# Altium schematic sheet Motor.SchDoc
size A4
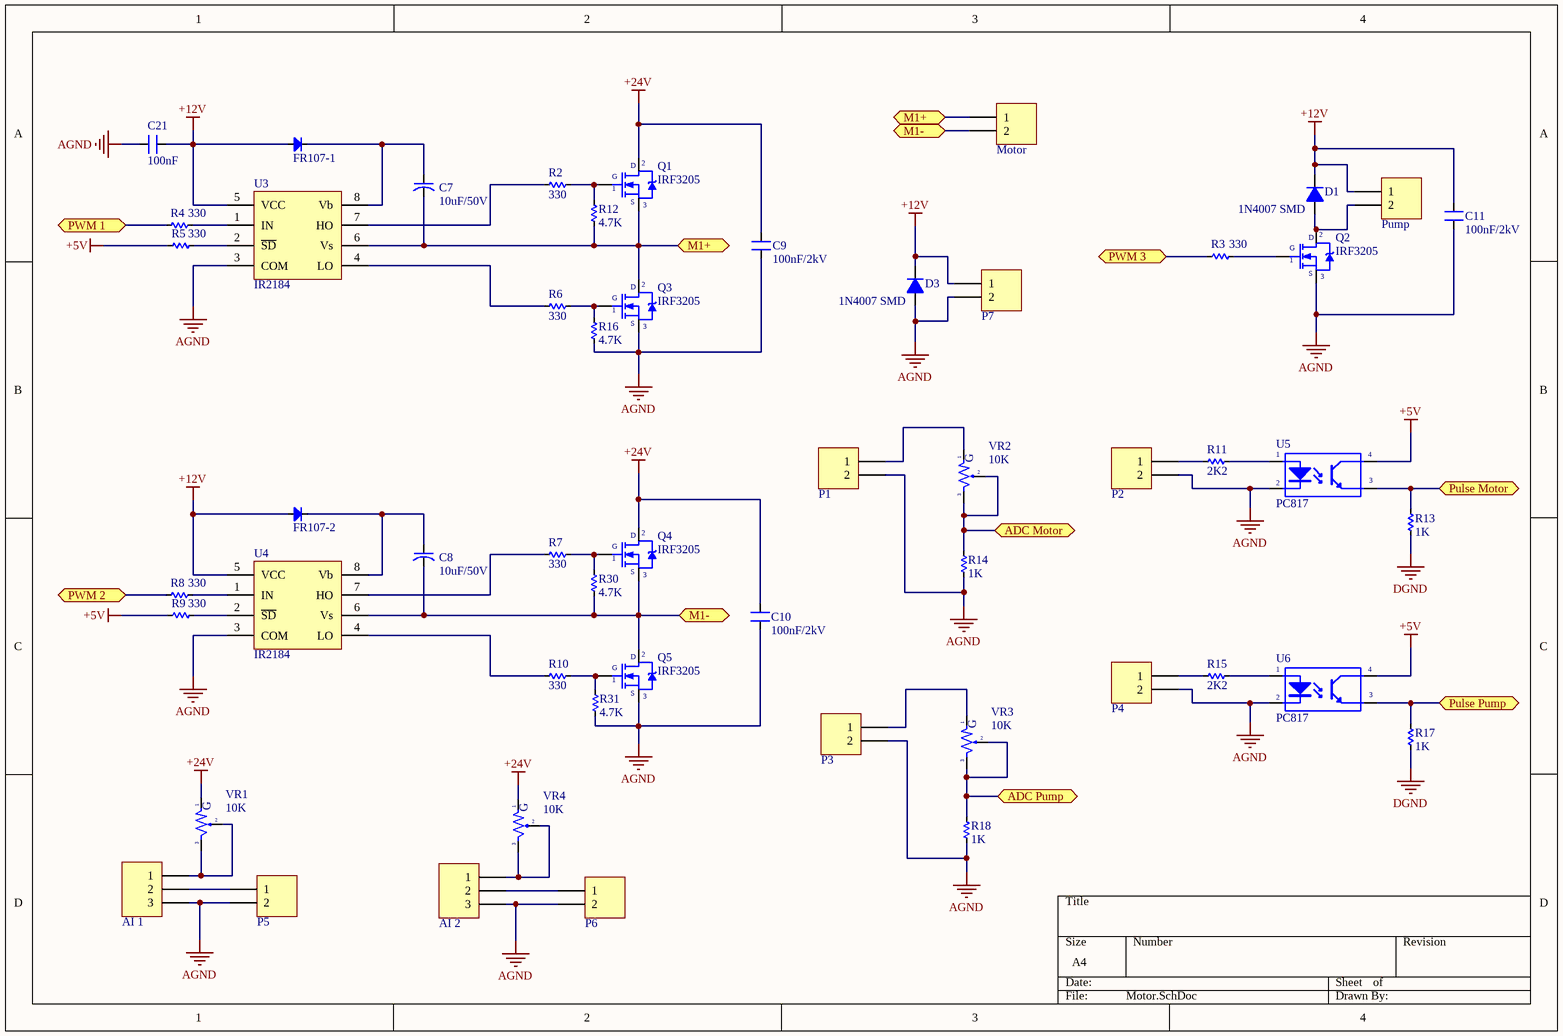
[diagram p0: Motor.SchDoc]

## Parts
AI_1  Domino 3  [Header Bus 3]  (value not drawn)
AI_2  Domino 3  [Header Bus 3]  (value not drawn)
C7  10uF/50V  [10uF/16V]
C8  10uF/50V  [10uF/16V]
C9  100nF/2kV  [CN3]
C10  100nF/2kV  [CN3]
C11  100nF/2kV  [CN3]
C21  100nF  [CN-SMD-0805]
D1  1N4007 SMD  [1N4004-M4 SMD]
D3  1N4007 SMD  [1N4004-M4 SMD]
FR107-1  Diode  [SS34]  (value not drawn)
FR107-2  Diode  [SS34]  (value not drawn)
Motor  Domino 2H  [DOMINO 2-5mm -H]  (value not drawn)
P1  Domino 2  [Header Bus 2]  (value not drawn)
P2  Domino 2  [Header Bus 2]  (value not drawn)
P3  Domino 2  [Header Bus 2]  (value not drawn)
P4  Domino 2  [Header Bus 2]  (value not drawn)
P5  Domino 2  [Header Bus 2]  (value not drawn)
P6  Domino 2  [Header Bus 2]  (value not drawn)
P7  Domino 2  [Header Bus 2]  (value not drawn)
Pump  Domino 2H  [DOMINO 2-5mm -H]  (value not drawn)
Q1  IRF3205  [TO220-123]
Q2  IRF3205  [TO220-123]
Q3  IRF3205  [TO220-123]
Q4  IRF3205  [TO220-123]
Q5  IRF3205  [TO220-123]
R2  330  [RES-SM-0805]
R3  330  [RES-SM-0805]
R4  330  [RES-SM-0805]
R5  330  [RES-SM-0805]
R6  330  [RES-SM-0805]
R7  330  [RES-SM-0805]
R8  330  [RES-SM-0805]
R9  330  [RES-SM-0805]
R10  330  [RES-SM-0805]
R11  2K2  [RES-SM-0805]
R12  4.7K  [RES-1/2W]
R13  1K  [RES-SM-0805]
R14  1K  [RES-SM-0805]
R15  2K2  [RES-SM-0805]
R16  4.7K  [RES-1/2W]
R17  1K  [RES-SM-0805]
R18  1K  [RES-SM-0805]
R30  4.7K  [RES-1/2W]
R31  4.7K  [RES-1/2W]
U3  IR2184  [SO8]
U4  IR2184  [SO8]
U5  PC817  [DIP4]
U6  PC817  [DIP4]
VR1  10K  [VR-S2]
VR2  10K  [VR-S2]
VR3  10K  [VR-S2]
VR4  10K  [VR-S2]

## Ports
ADC Motor (bidir), ADC Pump (bidir), M1+ (bidir), M1- (bidir), Pulse Motor (bidir), Pulse Pump (bidir), PWM 1 (bidir), PWM 2 (bidir), PWM 3 (bidir)

## Nets
+5V: R5.2 R9.2 U5.4(C) U6.4(C)
+12V: C11.2 C21.1 D1.1(K) D3.1(K) FR107-1.1(A) FR107-2.1(A) P7.1 Pump.1 U3.5(VCC) U4.5(VCC)
+24V: C9.2 C10.2 Q1.2(D) Q4.2(D) VR1.1 VR4.1
AGND: AI_1.3 AI_2.3 C9.1 C10.1 C11.1 C21.2 D3.2(A) P1.2 P2.2 P3.2 P4.2 P5.2 P6.2 P7.2 Q2.3(S) Q3.3(S) Q5.3(S) R14.2 R16.2 R18.2 R31.2 U3.3(COM) U4.3(COM) U5.2(K) U6.2(K)
DGND: R13.2 R17.2
ADC Motor: R14.1 VR2.2 VR2.3 ; port ADC Motor
ADC Pump: R18.1 VR3.2 VR3.3 ; port ADC Pump
M1+: C7.2 Motor.1 Q1.3(S) Q3.2(D) R12.2 U3.6(Vs) ; port M1+
M1-: C8.2 Motor.2 Q4.3(S) Q5.2(D) R30.2 U4.6(Vs) ; port M1-
Pulse Motor: R13.1 U5.3(E) ; port Pulse Motor
Pulse Pump: R17.1 U6.3(E) ; port Pulse Pump
PWM 1: R4.2 ; port PWM 1
PWM 2: R8.2 ; port PWM 2
PWM 3: R3.2 ; port PWM 3
NetAI_1_1: AI_1.1 VR1.2 VR1.3
NetAI_1_2: AI_1.2 P5.1
NetAI_2_1: AI_2.1 VR4.2 VR4.3
NetAI_2_2: AI_2.2 P6.1
NetC7_1: C7.1 FR107-1.2(K) U3.8(Vb)
NetC8_1: C8.1 FR107-2.2(K) U4.8(Vb)
NetD1_2: D1.2(A) Pump.2 Q2.2(D)
NetP1_1: P1.1 VR2.1
NetP2_1: P2.1 R11.2
NetP3_1: P3.1 VR3.1
NetP4_1: P4.1 R15.2
NetQ1_1: Q1.1(G) R2.1 R12.1
NetQ2_1: Q2.1(G) R3.1
NetQ3_1: Q3.1(G) R6.1 R16.1
NetQ4_1: Q4.1(G) R7.1 R30.1
NetQ5_1: Q5.1(G) R10.1 R31.1
NetR2_2: R2.2 U3.7(HO)
NetR4_1: R4.1 U3.1(IN)
NetR5_1: R5.1 U3.2(~{SD})
NetR6_2: R6.2 U3.4(LO)
NetR7_2: R7.2 U4.7(HO)
NetR8_1: R8.1 U4.1(IN)
NetR9_1: R9.1 U4.2(~{SD})
NetR10_2: R10.2 U4.4(LO)
NetR11_1: R11.1 U5.1(A)
NetR15_1: R15.1 U6.1(A)

## Notes on the sheet
- (in symbol VR-S) G

## Library data of the parts
AI_1 AI_2 = Domino 3: Domino 3-Pin; LatestRevisionDate: 17-Jul-2002; LatestRevisionNote: Re-released for DXP Platform.; Publisher: Altium Limited
C7 C8 = Polary Capacitor: DIP Footprint
C9-C11 = CN3: Cap np W0.3; Value: 0,047uF; Copyright: VanDungEvn
C21 = CN: Value: 33pF
D1 D3 = 1N4004-M4 SMD
FR107-1 FR107-2 = Diode: Default Diode; Code - JEDEC: DO-214-AB; Value: 1N5007; Published: 8-Jun-2000; Revision: July-2002: Re-released for DXP Platform.; Publisher: Altium Limited
Motor Pump = Domino 2H: Domino 2-Pin, Right Angle; LatestRevisionDate: 17-Jul-2002; LatestRevisionNote: Re-released for DXP Platform.; Publisher: Altium Limited
P1-P7 = Domino 2: Domino, 2-Pin; LatestRevisionDate: 17-Jul-2002; LatestRevisionNote: Re-released for DXP Platform.; Publisher: Altium Limited
Q1-Q5 = IRF840: MOSFET N - CHANNEL 500V - 0.75 - 8A - TO-220; Value: IRF840
R2-R18 R30 R31 = Res: Manufacturer: Generic Components; Class: Passive; SubClass: R; Published: 08/06/2000; Publisher: Altium Hobart Technology Centre
U3 U4 = IR2184: Half-Bridge Driver
U5 U6 = PC817: Single Opto; Value: PC817
VR1-VR4 = VR-S: Var Resistor; Value: Volume 50k